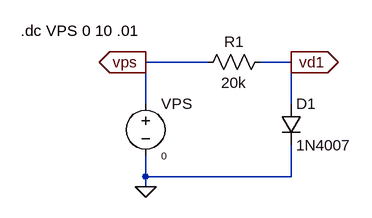
[diagram p0: schematic exer1_10.asc]
exer1_10.asc, the LTspice schematic file:
Version 4
SHEET 1 880 680
WIRE 192 80 96 80
WIRE 320 80 272 80
WIRE 96 144 96 80
WIRE 320 144 320 80
WIRE 96 256 96 224
WIRE 320 256 320 208
WIRE 320 256 96 256
WIRE 96 272 96 256
FLAG 96 272 0
FLAG 320 80 vd1
IOPIN 320 80 Out
FLAG 96 80 vps
IOPIN 96 80 Out
SYMBOL voltage 96 128 R0
WINDOW 3 24 96 Left 1
SYMATTR InstName VPS
SYMATTR Value 0
SYMBOL res 288 64 R90
WINDOW 0 0 56 VBottom 2
WINDOW 3 32 56 VTop 2
SYMATTR InstName R1
SYMATTR Value 20k
SYMBOL diode 304 144 R0
SYMATTR InstName D1
SYMATTR Value 1N4007
TEXT -96 32 Left 2 !.dc VPS 0 10 .01

The netlist it stands for:
* exer1_10.asc
VPS vps 0 0
R1 vd1 vps 20k
D1 vd1 0 1N4007
.model D D
.lib standard.dio
.dc VPS 0 10 .01
.backanno
.end